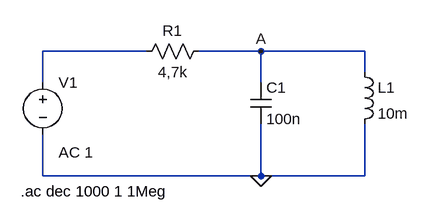
[diagram p0: schematic p5_prev.asc]
p5_prev.asc, the LTspice schematic file:
Version 4
SHEET 1 880 680
WIRE 240 96 80 96
WIRE 416 96 320 96
WIRE 576 96 416 96
WIRE 576 128 576 96
WIRE 80 144 80 96
WIRE 416 144 416 96
WIRE 80 288 80 224
WIRE 416 288 416 208
WIRE 416 288 80 288
WIRE 576 288 576 208
WIRE 576 288 416 288
FLAG 416 288 0
FLAG 416 96 A
SYMBOL voltage 80 128 R0
WINDOW 123 24 124 Left 2
WINDOW 39 0 0 Left 0
SYMATTR InstName V1
SYMATTR Value ""
SYMATTR Value2 AC 1
SYMBOL res 336 80 R90
WINDOW 0 0 56 VBottom 2
WINDOW 3 32 56 VTop 2
SYMATTR InstName R1
SYMATTR Value 4,7k
SYMBOL cap 400 144 R0
SYMATTR InstName C1
SYMATTR Value 100n
SYMBOL ind 560 112 R0
SYMATTR InstName L1
SYMATTR Value 10m
SYMATTR SpiceLine Rser=40
TEXT 46 312 Left 2 !.ac dec 1000 1 1Meg

The netlist it stands for:
* p5_prev.asc
V1 N001 0 AC 1
R1 A N001 4,7k
C1 A 0 100n
L1 A 0 10m Rser=40
.ac dec 1000 1 1Meg
.backanno
.end

* Results of the author's LTspice run, read from the files saved beside the schematic
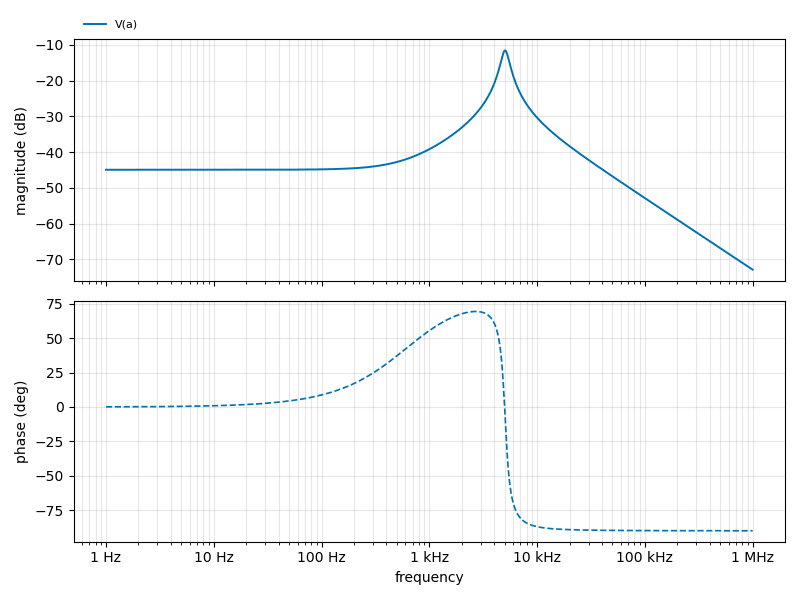
[diagram p1: AC Analysis of p5_prev.asc, plotted from the saved traces]
* AC Analysis, 1 run:
*   V(a): -44.91 dB at 1 Hz, -72.87 dB at 1 MHz, peak -11.53 dB at 5.047 kHz, 3 dB below the peak at 4.633 kHz and 5.497 kHz